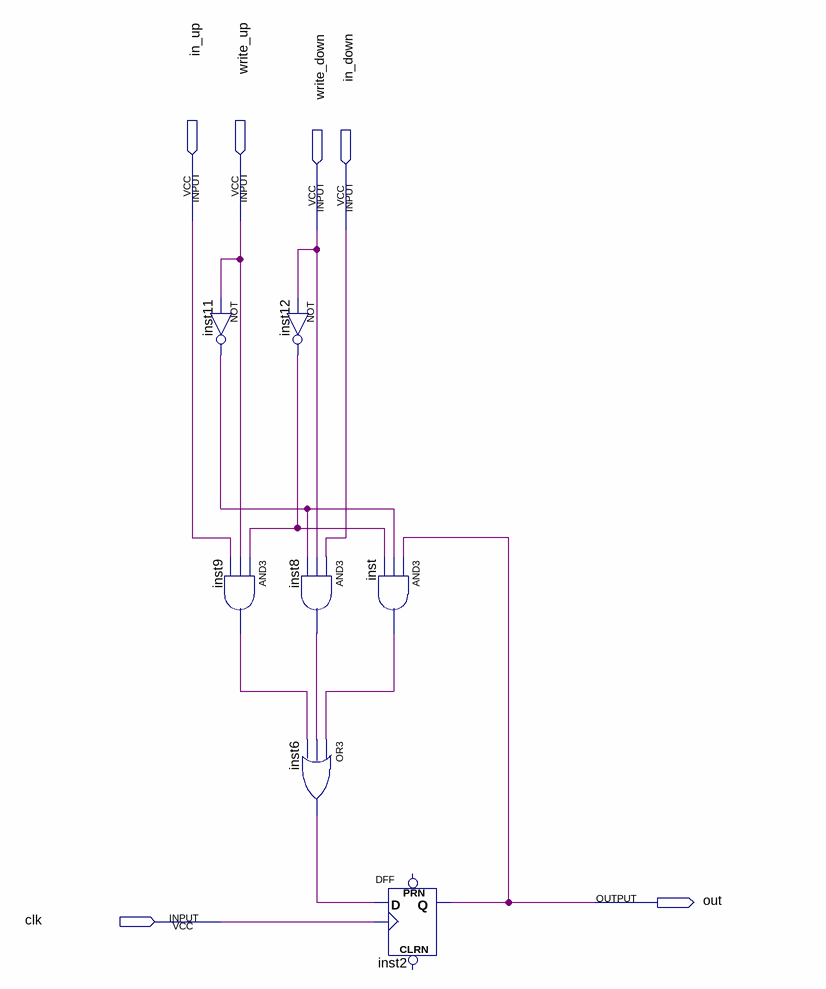
[diagram p0: schematic sheet]
// Quartus schematic REG_1BIT_SWAP.bdf as structural Verilog: 7 symbols, 6 pins
module REG_1BIT_SWAP (
  input  in_up,
  input  write_up,
  input  write_down,
  input  in_down,
  input  clk,
  output out
);

  wire inst6_out, inst8_out, inst9_out, inst11_out, inst12_out, inst_out;

  not inst11 (inst11_out, write_up);
  not inst12 (inst12_out, write_down);
  and inst9 (inst9_out, inst12_out, write_up, in_up);
  and inst8 (inst8_out, in_down, write_down, inst11_out);
  or inst6 (inst6_out, inst_out, inst8_out, inst9_out);
  and inst (inst_out, out, inst11_out, inst12_out);
  DFF inst2 (.CLK(clk), .D(inst6_out), .Q(out));  // open: CLRN, PRN
endmodule
